# Altium schematic sheet Sheet4.SchDoc
size A4; SheetNumber: 4; SheetTotal: 6
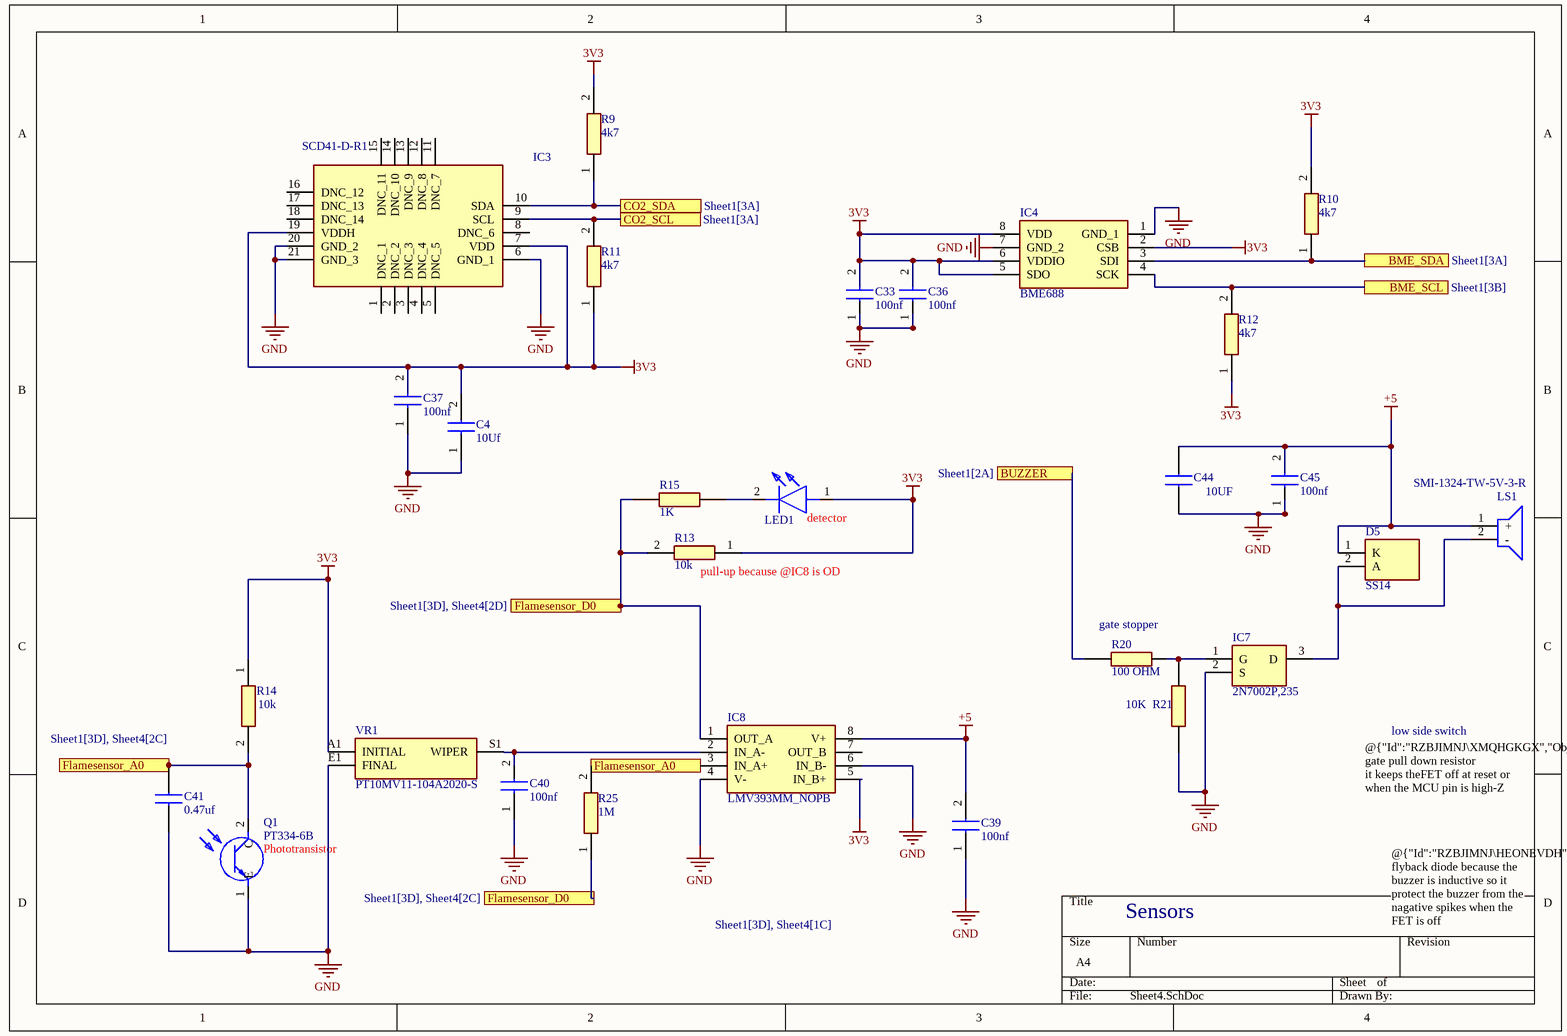
[diagram p0: Sheet4.SchDoc]

## Parts
C4  10Uf  [CAPC1608X95N]
C33  100nf  [CAPC1608X95N]
C36  100nf  [CAPC1608X95N]
C37  100nf  [CAPC1608X95N]
C39  100nf  [CAPC1608X95N]
C40  100nf  [CAPC1608X95N]
C41  0.47uf  [CAPC1608X90N]
C44  10UF  [CAPC1608X90N]
C45  100nf  [CAPC1608X95N]
D5  SS14  [DIOM5026X262N]
IC3  SCD41-D-R1  [SCD41DR1]
IC4  BME688  [BME688]
IC7  2N7002P,235  [SOT95P230X110-3N]
IC8  LMV393MM_NOPB  [SOP65P490X110-8N]
LED1  KPTL-3216SURCK-01-VS  [KPTL3216SURCK01VS]  (value not drawn)
LS1  SMI-1324-TW-5V-3-R  [SMI1324TW5V3R]
Q1  PT334-6B  [PT3346B]
R9  4k7  [RESC1608X55N]
R10  4k7  [RESC1608X55N]
R11  4k7  [RESC1608X55N]
R12  4k7  [RESC1608X55N]
R13  10k  [RESC1608X55N]
R14  10k  [RESC1608X55N]
R15  1K  [RESC1608X50N]
R20  100 OHM  [RESC1608X55N]
R21  10K  [RESC1608X50N]
R25  1M  [RESC1608X55N]
VR1  PT10MV11-104A2020-S  [PT10MV11104A2020S]

## Ports
BME_SCL (see Sheet1[3B]), BME_SDA (see Sheet1[3A]), BUZZER (see Sheet1[2A]), CO2_SCL (see Sheet1[3A]), CO2_SDA (see Sheet1[3A]), Flamesensor_A0 (see Sheet1[3D], Sheet4[1C]), Flamesensor_A0 (see Sheet1[3D], Sheet4[2C]), Flamesensor_D0 (see Sheet1[3D], Sheet4[2C]), Flamesensor_D0 (see Sheet1[3D], Sheet4[2D])

## Nets
3V3: C4.2 C33.2 C36.2 C37.2 IC3.7(VDD) IC3.19(VDDH) IC4.2(CSB) IC4.5(SDO) IC4.6(VDDIO) IC4.8(VDD) IC8.5(IN_B+) LED1.1(A) R9.2 R10.2 R11.1 R12.1 R13.1 R14.1 VR1.A1(INITIAL)
+5: C39.2 C44.2 C45.2 D5.1(K) IC8.8(V+) LS1.1(+)
GND: C4.1 C33.1 C36.1 C37.1 C39.1 C40.1 C41.1 C44.1 C45.1 IC3.6(GND_1) IC3.20(GND_2) IC3.21(GND_3) IC4.1(GND_1) IC4.7(GND_2) IC7.2(S) IC8.4(V-) IC8.6(IN_B-) Q1.1(E) R21.1 VR1.E1(FINAL)
BME_SCL: IC4.4(SCK) R12.2 ; port BME_SCL
BME_SDA: IC4.3(SDI) R10.1 ; port BME_SDA
BUZZER: R20.1 ; port BUZZER
CO2_SCL: IC3.9(SCL) R11.2 ; port CO2_SCL
CO2_SDA: IC3.10(SDA) R9.1 ; port CO2_SDA
Flamesensor_A0: C41.2 IC8.3(IN_A+) Q1.2(C) R14.2 R25.2 ; port Flamesensor_A0
Flamesensor_D0: IC8.1(OUT_A) R13.2 R15.1 R25.1 ; port Flamesensor_D0
NetC40_2: C40.2 IC8.2(IN_A-) VR1.S1(WIPER)
NetD5_2: D5.2(A) IC7.3(D) LS1.2(-)
NetIC7_1: IC7.1(G) R20.2 R21.2
NetLED1_2: LED1.2(K) R15.2

Not connected (* = marked no-connect by the designer): IC3 1(DNC_1) 2(DNC_2) 3(DNC_3) 4(DNC_4) 5(DNC_5) 8(DNC_6) 11(DNC_7) 12(DNC_8) 13(DNC_9) 14(DNC_10) 15(DNC_11) 16(DNC_12) 17(DNC_13) 18(DNC_14); IC8 7(OUT_B)

## Notes on the sheet
- (near R13) pull-up because @IC8 is OD
- (near LED1) detector
- (near R20) gate stopper
- low side switch
- (near Q1) Phototransistor
- @{"Id":"RZBJIMNJ\XMQHGKGX","ObjectType":2} gate pull down resistor                                                              it keeps theFET off at reset or when the MCU pin is high-Z
- Sensors
- @{"Id":"RZBJIMNJ\HEONEVDH","ObjectType":2}
  flyback diode because the buzzer is inductive so it protect the buzzer from the nagative spikes when the FET is off

## Library data of the parts
C4 C33 C36 C37 C39 C40 C45 = VJ0603Y104KXACW1BC: Capacitor; Manufacturer_Name: Vishay; Datasheet Link: https://componentsearchengine.com/Datasheets/2/VJ0603Y104KXACW1BC.pdf; Height: 0.95mm; Manufacturer_Part_Number: VJ0603Y104KXACW1BC; Mouser Part Number: N/A; Mouser Price/Stock: https://www.mouser.co.uk/ProductDetail/Vishay-Vitramon/VJ0603Y104KXACW1BC?qs=M%2FcR%2FDpCXFVPJpohemA31Q%3D%3D; Arrow Part Number: VJ0603Y104KXACW1BC; Arrow Price/Stock: https://www.arrow.com/en/products/vj0603y104kxacw1bc/vishay?utm_currency=USD&region=nac
C41 = CC0603KRX7R6BB474: Phycomp 0603 Standard 470nF Ceramic Multilayer Capacitor, 10 V dc, +125C, X7R Dielectric, +/-10% SMD; Manufacturer_Name: KEMET; Geometry.Height: 0.9mm; Manufacturer_Part_Number: CC0603KRX7R6BB474; Mouser Part Number: 603-CC603KRX7R6BB474; Mouser Price/Stock: https://www.mouser.com/Search/Refine.aspx?Keyword=603-CC603KRX7R6BB474; Arrow Part Number: CC0603KRX7R6BB474; Arrow Price/Stock: https://www.arrow.com/en/products/cc0603krx7r6bb474/yageo; Datasheet Link: https://www.yageo.com/upload/media/product/productsearch/datasheet/mlcc/UPY-NP0X7R_MV_100-to-630V_24.pdf
C44 = CL10A106KP8NNNC: 10F +/-10% 10V Ceramic Capacitor X5R 0603 (1608 Metric); Manufacturer_Name: SAMSUNG; Geometry.Height: 0.9mm; Manufacturer_Part_Number: CL10A106KP8NNNC; Mouser Part Number: 187-CL10A106KP8NNNC; Mouser Price/Stock: https://www.mouser.co.uk/ProductDetail/Samsung-Electro-Mechanics/CL10A106KP8NNNC?qs=X6jEic%2FHinAlyfRHj7fKwg%3D%3D; Arrow Part Number: CL10A106KP8NNNC; Arrow Price/Stock: https://www.arrow.com/en/products/cl10a106kp8nnnc/samsung-electro-mechanics?utm_currency=USD&region=europe; Datasheet Link: https://datasheet.datasheetarchive.com/originals/distributors/Datasheets-DGA10/2415998.pdf
D5 = SS14: Battery; Manufacturer_Name: HY Electronic; Datasheet Link: http://uk.rs-online.com/web/p/products/1711446; Height: 2.62mm; Manufacturer_Part_Number: SS14
IC3 = SCD41-D-R1: Integrated Circuit; Manufacturer_Name: Sensirion; Datasheet Link: https://sensirion.com/media/documents/48C4B7FB/64C134E7/Sensirion_SCD4x_Datasheet.pdf; Height: 6.8mm; Manufacturer_Part_Number: SCD41-D-R1; Mouser Part Number: 403-SCD41-D-R1; Mouser Price/Stock: https://www.mouser.co.uk/ProductDetail/Sensirion/SCD41-D-R1?qs=HBWAp0VN4Rg1hR6vTmplbw%3D%3D; Arrow Part Number: SCD41-D-R1; Arrow Price/Stock: https://www.arrow.com/en/products/scd41-d-r1/sensirion-ag?utm_currency=USD&region=nac
IC4 = BME688: Integrated Circuit; Manufacturer_Name: BOSCH; Datasheet Link: https://www.bosch-sensortec.com/media/boschsensortec/downloads/datasheets/bst-bme688-ds000.pdf; Height: 1mm; Manufacturer_Part_Number: BME688; Mouser Part Number: 262-BME688; Mouser Price/Stock: https://www.mouser.co.uk/ProductDetail/Bosch-Sensortec/BME688?qs=IS%252B4QmGtzzqQoVDscqwx3A%3D%3D; Arrow Part Number: BME688; Arrow Price/Stock: https://www.arrow.com/en/products/bme688/bosch-sensortec?utm_currency=USD&region=nac
IC7 = 2N7002P,235: Integrated Circuit; Manufacturer_Name: Nylofix; Datasheet Link: https://4donline.ihs.com/images/VipMasterIC/IC/PHGL/PHGLS21946/PHGLS21946-1.pdf?hkey=EF798316E3902B6ED9A73243A3159BB0; Height: 1.1mm; Manufacturer_Part_Number: 2N7002P,235
IC8 = LMV393MM_NOPB: Integrated Circuit; Manufacturer_Name: Texas Instruments; Manufacturer_Part_Number: LMV393MM/NOPB; Datasheet Link: http://www.ti.com/lit/ds/symlink/lmv393-n.pdf; Height: 1.1mm; Mouser Part Number: 926-LMV393MM/NOPB; Mouser Price/Stock: https://www.mouser.co.uk/ProductDetail/Texas-Instruments/LMV393MM-NOPB?qs=7lkVKPoqpbZkPkHa4IaJJg%3D%3D; Arrow Part Number: LMV393MM/NOPB; Arrow Price/Stock: https://www.arrow.com/en/products/lmv393mmnopb/texas-instruments
LED1 = KPTL-3216SURCK-01-VS: LED; Manufacturer_Name: Kingbright; Datasheet Link: http://www.farnell.com/datasheets/1655872.pdf; Height: 1.2mm; Manufacturer_Part_Number: KPTL-3216SURCK-01-VS; Mouser Part Number: N/A; Mouser Price/Stock: https://www.mouser.co.uk/ProductDetail/Kingbright/KPTL-3216SURCK-01-VS?qs=5DWHFlm3M2sATWsF9Oia%2FA%3D%3D
LS1 = SMI-1324-TW-5V-3-R: Loudspeaker or Buzzer; Manufacturer_Name: PUI Audio; Datasheet Link: https://api.puiaudio.com/filename/SMI-1324-TW-5V-3-R.pdf; Height: 7.5mm; Manufacturer_Part_Number: SMI-1324-TW-5V-3-R; Mouser Part Number: 665-SMI1324TW5V3R; Mouser Price/Stock: https://www.mouser.co.uk/ProductDetail/PUI-Audio/SMI-1324-TW-5V-3-R?qs=KCAtXnBvhdTXmKSoqYS0Mw%3D%3D
Q1 = PT334-6B: Phototransistor; Manufacturer_Name: Everlight; Datasheet Link: https://www.mouser.com/datasheet/2/143/PT334-6B-1663203.pdf; Manufacturer_Part_Number: PT334-6B; Mouser Part Number: 638-PT3346B; Mouser Price/Stock: https://www.mouser.co.uk/ProductDetail/Everlight/PT334-6B?qs=8PzhAHr7IdOmCssrIssUEQ%3D%3D; Arrow Part Number: PT334-6B; Arrow Price/Stock: https://www.arrow.com/en/products/pt334-6b/everlight-electronics?region=nac
R9-R12 = CRCW06034K70JNEAC: Resistor; Manufacturer_Name: Vishay; Datasheet Link: http://www.vishay.com/docs/28773/crcwce3.pdf; Height: 0.55mm; Manufacturer_Part_Number: CRCW06034K70JNEAC; Mouser Part Number: 71-CRCW06034K70JNEAC; Mouser Price/Stock: https://www.mouser.co.uk/ProductDetail/Vishay-Dale/CRCW06034K70JNEAC?qs=E3Y5ESvWgWMzBuUf0K3dnA%3D%3D; Arrow Part Number: CRCW06034K70JNEAC; Arrow Price/Stock: https://www.arrow.com/en/products/crcw06034k70jneac/vishay?region=nac
R13 R14 R25 = RC0603FR-071KL: Resistor; Manufacturer_Name: YAGEO; Datasheet Link: https://www.yageo.com/upload/media/product/productsearch/datasheet/rchip/PYu-RC_Group_51_RoHS_L_12.pdf; Height: 0.55mm; Manufacturer_Part_Number: RC0603FR-071KL; Mouser Part Number: 603-RC0603FR-071KL; Mouser Price/Stock: https://www.mouser.co.uk/ProductDetail/YAGEO/RC0603FR-071KL?qs=VU8sRB4EgwApHsk4rF%2F3zg%3D%3D; Arrow Part Number: RC0603FR-071KL; Arrow Price/Stock: https://www.arrow.com/en/products/rc0603fr-071kl/yageo?utm_currency=USD&region=nac
R15 = CRCW06031K00FKEA: CRCW0603 Resistor T/R 0.10W,1%,1K Vishay CRCW Series Thick Film Surface Mount Resistor 0603 Case 1k +/-1% 0.1W +/-100ppm/C; Geometry.Height: 0.5mm; Manufacturer_Name: Vishay; Manufacturer_Part_Number: CRCW06031K00FKEA; Mouser Part Number: 71-CRCW0603-1.0K-E3; Mouser Price/Stock: https://www.mouser.co.uk/ProductDetail/Vishay-Dale/CRCW06031K00FKEA?qs=CToX950LohJasujQx7GY3g%3D%3D; Arrow Part Number: CRCW06031K00FKEA; Arrow Price/Stock: https://www.arrow.com/en/products/crcw06031k00fkea/vishay?utm_currency=USD&region=nac; Datasheet Link: http://www.vishay.com/docs/20035/dcrcwe3.pdf
R20 = TNPW0603100RFHEA: Res Thin Film 0603 100 Ohm 1% 0.1W(1/10W) +/-50ppm/C Sulfur Resistant Pad SMD Automotive Medical T/R; Manufacturer_Name: Vishay; Geometry.Height: 0.55mm; Manufacturer_Part_Number: TNPW0603100RFHEA; Mouser Part Number: *; Mouser Price/Stock: *; Arrow Part Number: TNPW0603100RFHEA; Arrow Price/Stock: https://www.arrow.com/en/products/tnpw0603100rfhea/vishay; Datasheet Link: https://www.vishay.com/docs/28758/tnpw_e3.pdf
R21 = RCA0603100KFKEA: 100 kOhms +/-1% 0.1W, 1/10W Chip Resistor 0603 (1608 Metric) Anti-Sulfur, Automotive AEC-Q200 Thick Film; Manufacturer_Name: Vishay; Geometry.Height: 0.5mm; Manufacturer_Part_Number: RCA0603100KFKEA; Mouser Part Number: 71-RCA0603100KFKEA; Mouser Price/Stock: https://www.mouser.com/Search/Refine.aspx?Keyword=71-RCA0603100KFKEA; Arrow Part Number: RCA0603100KFKEA; Arrow Price/Stock: https://www.arrow.com/en/products/rca0603100kfkea/vishay?utm_currency=USD&region=nac; Datasheet Link: https://www.vishay.com/docs/20037/rcae3.pdf
VR1 = PT10MV11-104A2020-S: Variable Resistor; Manufacturer_Name: PIHER; Datasheet Link: https://www.piher.net/wp-content/uploads/PIHER_PT-10_PTC-10.pdf; Height: 6mm; Manufacturer_Part_Number: PT10MV11-104A2020-S; Mouser Part Number: 531-PT10MV11104A22S; Mouser Price/Stock: https://www.mouser.co.uk/ProductDetail/Amphenol-Piher/PT10MV11-104A2020-S?qs=byeeYqUIh0P%252Byx82Crbo6w%3D%3D